# EAGLE design PGTNX01_teensy (EAGLE 8.5.2)
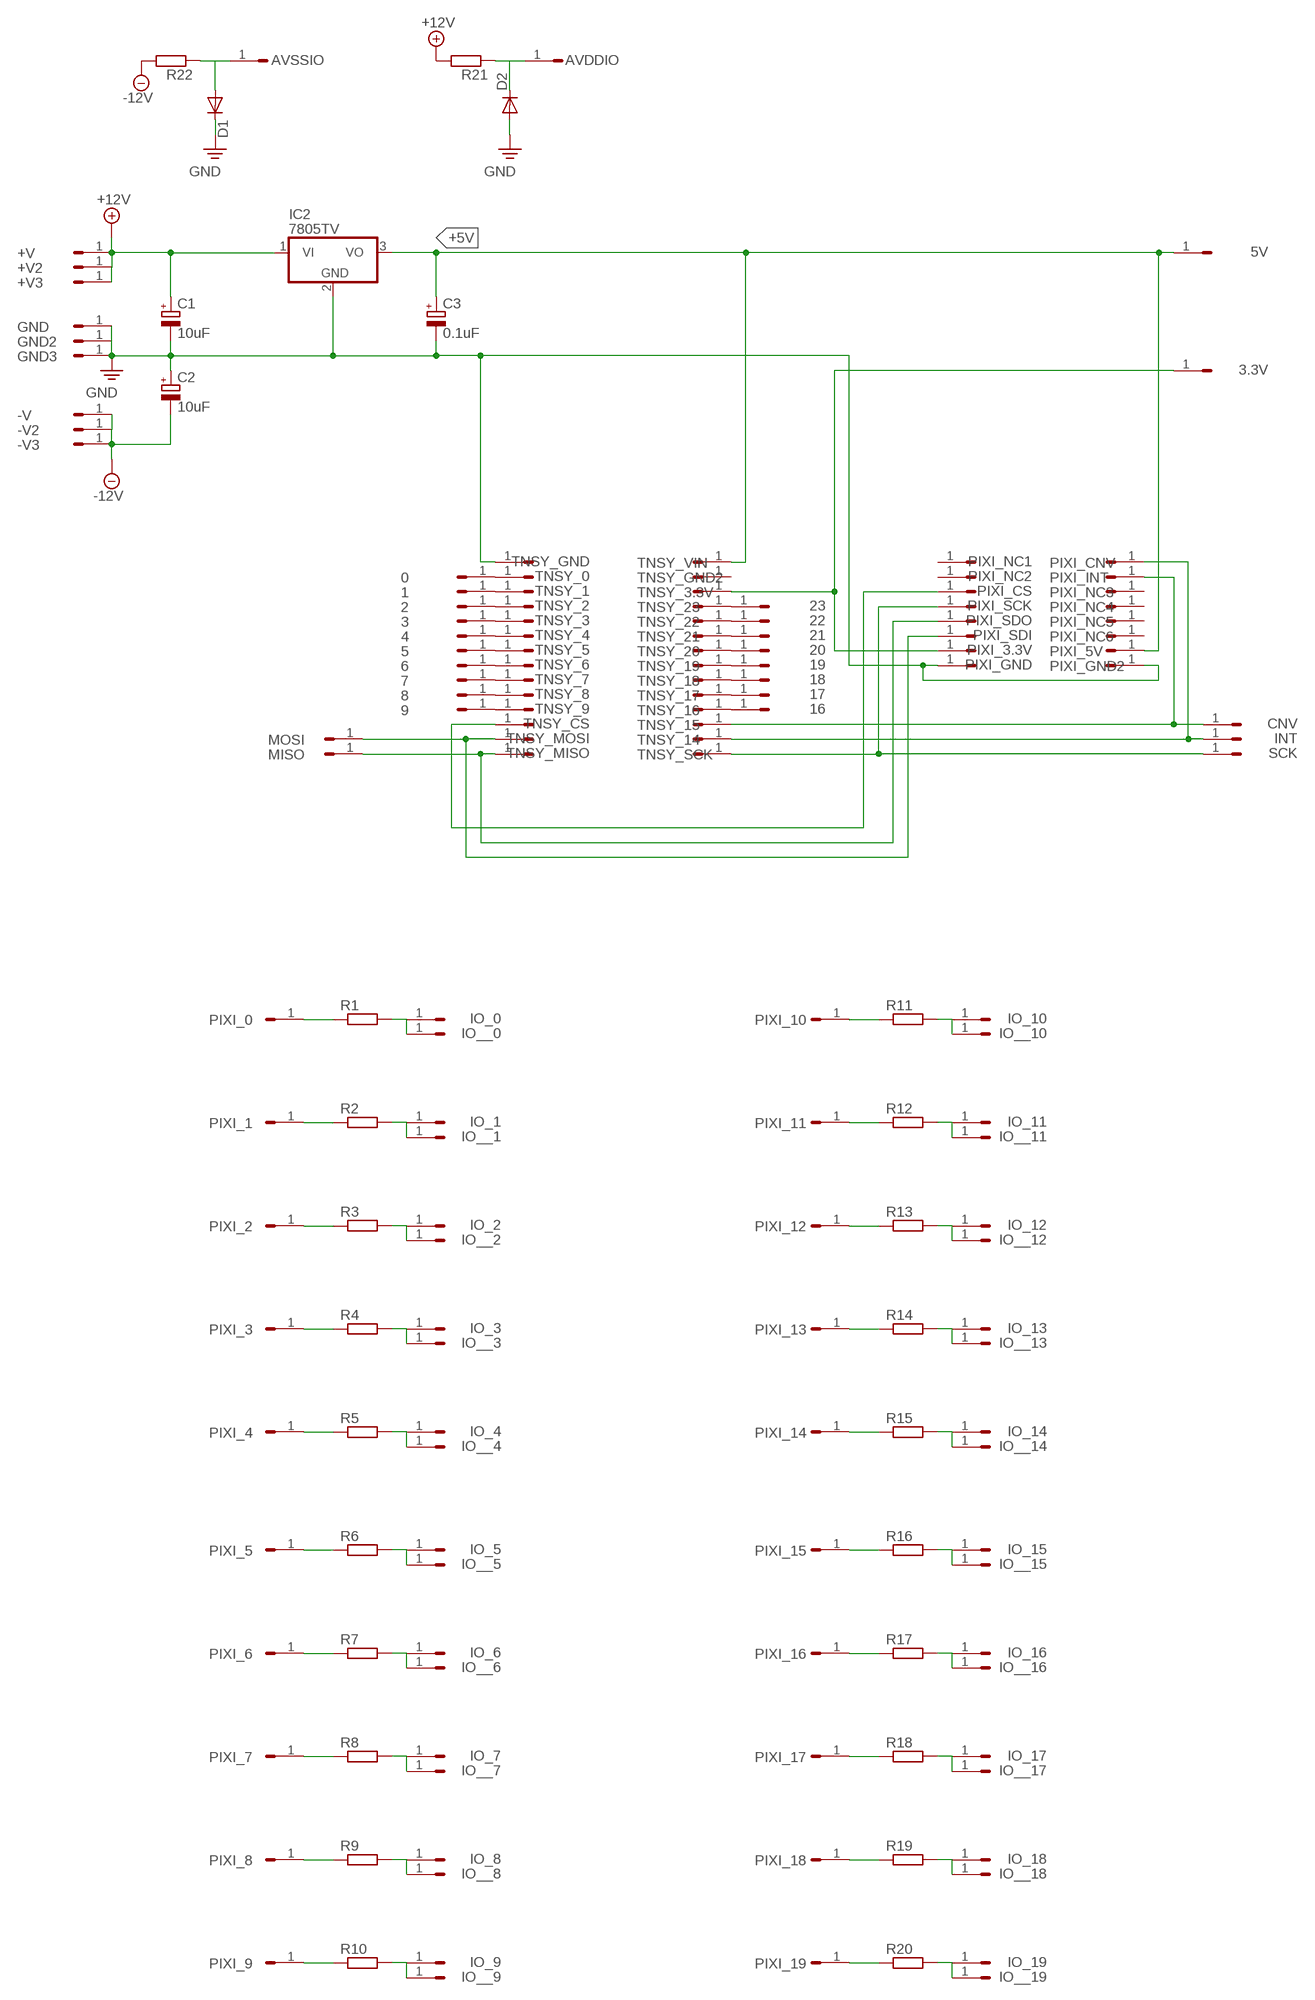
[diagram p0: schematic, sheet 1]

## Parts
0  HEADER/MALE/01  [HEADER/MALE/01]
1  HEADER/MALE/01  [HEADER/MALE/01]
2  HEADER/MALE/01  [HEADER/MALE/01]
3  HEADER/MALE/01  [HEADER/MALE/01]
3.3V  HEADER/MALE/01  [HEADER/MALE/01]
4  HEADER/MALE/01  [HEADER/MALE/01]
5  HEADER/MALE/01  [HEADER/MALE/01]
5V  HEADER/MALE/01  [HEADER/MALE/01]
6  HEADER/MALE/01  [HEADER/MALE/01]
7  HEADER/MALE/01  [HEADER/MALE/01]
8  HEADER/MALE/01  [HEADER/MALE/01]
9  HEADER/MALE/01  [HEADER/MALE/01]
16  HEADER/MALE/01  [HEADER/MALE/01]
17  HEADER/MALE/01  [HEADER/MALE/01]
18  HEADER/MALE/01  [HEADER/MALE/01]
19  HEADER/MALE/01  [HEADER/MALE/01]
20  HEADER/MALE/01  [HEADER/MALE/01]
21  HEADER/MALE/01  [HEADER/MALE/01]
22  HEADER/MALE/01  [HEADER/MALE/01]
23  HEADER/MALE/01  [HEADER/MALE/01]
+V  HEADER/MALE/01  [HEADER/MALE/01]
+V2  HEADER/MALE/01  [HEADER/MALE/01]
+V3  HEADER/MALE/01  [HEADER/MALE/01]
-V  HEADER/MALE/01  [HEADER/MALE/01]
-V2  HEADER/MALE/01  [HEADER/MALE/01]
-V3  HEADER/MALE/01  [HEADER/MALE/01]
AVDDIO  HEADER/MALE/01  [HEADER/MALE/01]
AVSSIO  HEADER/MALE/01  [HEADER/MALE/01]
C1  10uF  CAPACITOR/POLARIZEDE2.5-6  [E2,5-6]
C2  10uF  CAPACITOR/POLARIZEDE2.5-6  [E2,5-6]
C3  0.1uF  CAPACITOR/POLARIZEDE2.5-6  [E2,5-6]
CNV  HEADER/MALE/01  [HEADER/MALE/01]
D1  1N4148DO35-7  [DO35-7]
D2  1N4148DO35-7  [DO35-7]
GND  HEADER/MALE/01  [HEADER/MALE/01]
GND2  HEADER/MALE/01  [HEADER/MALE/01]
GND3  HEADER/MALE/01  [HEADER/MALE/01]
IC2  7805TV  [TO220V]
INT  HEADER/MALE/01  [HEADER/MALE/01]
IO_0  HEADER/MALE/01  [HEADER/MALE/01]
IO_1  HEADER/MALE/01  [HEADER/MALE/01]
IO_2  HEADER/MALE/01  [HEADER/MALE/01]
IO_3  HEADER/MALE/01  [HEADER/MALE/01]
IO_4  HEADER/MALE/01  [HEADER/MALE/01]
IO_5  HEADER/MALE/01  [HEADER/MALE/01]
IO_6  HEADER/MALE/01  [HEADER/MALE/01]
IO_7  HEADER/MALE/01  [HEADER/MALE/01]
IO_8  HEADER/MALE/01  [HEADER/MALE/01]
IO_9  HEADER/MALE/01  [HEADER/MALE/01]
IO_10  HEADER/MALE/01  [HEADER/MALE/01]
IO_11  HEADER/MALE/01  [HEADER/MALE/01]
IO_12  HEADER/MALE/01  [HEADER/MALE/01]
IO_13  HEADER/MALE/01  [HEADER/MALE/01]
IO_14  HEADER/MALE/01  [HEADER/MALE/01]
IO_15  HEADER/MALE/01  [HEADER/MALE/01]
IO_16  HEADER/MALE/01  [HEADER/MALE/01]
IO_17  HEADER/MALE/01  [HEADER/MALE/01]
IO_18  HEADER/MALE/01  [HEADER/MALE/01]
IO_19  HEADER/MALE/01  [HEADER/MALE/01]
IO__0  HEADER/MALE/01  [HEADER/MALE/01]
IO__1  HEADER/MALE/01  [HEADER/MALE/01]
IO__2  HEADER/MALE/01  [HEADER/MALE/01]
IO__3  HEADER/MALE/01  [HEADER/MALE/01]
IO__4  HEADER/MALE/01  [HEADER/MALE/01]
IO__5  HEADER/MALE/01  [HEADER/MALE/01]
IO__6  HEADER/MALE/01  [HEADER/MALE/01]
IO__7  HEADER/MALE/01  [HEADER/MALE/01]
IO__8  HEADER/MALE/01  [HEADER/MALE/01]
IO__9  HEADER/MALE/01  [HEADER/MALE/01]
IO__10  HEADER/MALE/01  [HEADER/MALE/01]
IO__11  HEADER/MALE/01  [HEADER/MALE/01]
IO__12  HEADER/MALE/01  [HEADER/MALE/01]
IO__13  HEADER/MALE/01  [HEADER/MALE/01]
IO__14  HEADER/MALE/01  [HEADER/MALE/01]
IO__15  HEADER/MALE/01  [HEADER/MALE/01]
IO__16  HEADER/MALE/01  [HEADER/MALE/01]
IO__17  HEADER/MALE/01  [HEADER/MALE/01]
IO__18  HEADER/MALE/01  [HEADER/MALE/01]
IO__19  HEADER/MALE/01  [HEADER/MALE/01]
MISO  HEADER/MALE/01  [HEADER/MALE/01]
MOSI  HEADER/MALE/01  [HEADER/MALE/01]
PIXI_0  HEADER/MALE/01  [HEADER/MALE/01]
PIXI_1  HEADER/MALE/01  [HEADER/MALE/01]
PIXI_2  HEADER/MALE/01  [HEADER/MALE/01]
PIXI_3  HEADER/MALE/01  [HEADER/MALE/01]
PIXI_3.3V  HEADER/MALE/01  [HEADER/MALE/01]
PIXI_4  HEADER/MALE/01  [HEADER/MALE/01]
PIXI_5  HEADER/MALE/01  [HEADER/MALE/01]
PIXI_5V  HEADER/MALE/01  [HEADER/MALE/01]
PIXI_6  HEADER/MALE/01  [HEADER/MALE/01]
PIXI_7  HEADER/MALE/01  [HEADER/MALE/01]
PIXI_8  HEADER/MALE/01  [HEADER/MALE/01]
PIXI_9  HEADER/MALE/01  [HEADER/MALE/01]
PIXI_10  HEADER/MALE/01  [HEADER/MALE/01]
PIXI_11  HEADER/MALE/01  [HEADER/MALE/01]
PIXI_12  HEADER/MALE/01  [HEADER/MALE/01]
PIXI_13  HEADER/MALE/01  [HEADER/MALE/01]
PIXI_14  HEADER/MALE/01  [HEADER/MALE/01]
PIXI_15  HEADER/MALE/01  [HEADER/MALE/01]
PIXI_16  HEADER/MALE/01  [HEADER/MALE/01]
PIXI_17  HEADER/MALE/01  [HEADER/MALE/01]
PIXI_18  HEADER/MALE/01  [HEADER/MALE/01]
PIXI_19  HEADER/MALE/01  [HEADER/MALE/01]
PIXI_CNV  HEADER/MALE/01  [HEADER/MALE/01]
PIXI_CS  HEADER/MALE/01  [HEADER/MALE/01]
PIXI_GND  HEADER/MALE/01  [HEADER/MALE/01]
PIXI_GND2  HEADER/MALE/01  [HEADER/MALE/01]
PIXI_INT  HEADER/MALE/01  [HEADER/MALE/01]
PIXI_NC1  HEADER/MALE/01  [HEADER/MALE/01]
PIXI_NC2  HEADER/MALE/01  [HEADER/MALE/01]
PIXI_NC3  HEADER/MALE/01  [HEADER/MALE/01]
PIXI_NC4  HEADER/MALE/01  [HEADER/MALE/01]
PIXI_NC5  HEADER/MALE/01  [HEADER/MALE/01]
PIXI_NC6  HEADER/MALE/01  [HEADER/MALE/01]
PIXI_SCK  HEADER/MALE/01  [HEADER/MALE/01]
PIXI_SDI  HEADER/MALE/01  [HEADER/MALE/01]
PIXI_SDO  HEADER/MALE/01  [HEADER/MALE/01]
R1  RESISTORRESISTOR/UPRIGHT/7.5  [RESISTOR/7.5]
R2  RESISTORRESISTOR/UPRIGHT/7.5  [RESISTOR/7.5]
R3  RESISTORRESISTOR/UPRIGHT/7.5  [RESISTOR/7.5]
R4  RESISTORRESISTOR/UPRIGHT/7.5  [RESISTOR/7.5]
R5  RESISTORRESISTOR/UPRIGHT/7.5  [RESISTOR/7.5]
R6  RESISTORRESISTOR/UPRIGHT/7.5  [RESISTOR/7.5]
R7  RESISTORRESISTOR/UPRIGHT/7.5  [RESISTOR/7.5]
R8  RESISTORRESISTOR/UPRIGHT/7.5  [RESISTOR/7.5]
R9  RESISTORRESISTOR/UPRIGHT/7.5  [RESISTOR/7.5]
R10  RESISTORRESISTOR/UPRIGHT/7.5  [RESISTOR/7.5]
R11  RESISTORRESISTOR/UPRIGHT/7.5  [RESISTOR/7.5]
R12  RESISTORRESISTOR/UPRIGHT/7.5  [RESISTOR/7.5]
R13  RESISTORRESISTOR/UPRIGHT/7.5  [RESISTOR/7.5]
R14  RESISTORRESISTOR/UPRIGHT/7.5  [RESISTOR/7.5]
R15  RESISTORRESISTOR/UPRIGHT/7.5  [RESISTOR/7.5]
R16  RESISTORRESISTOR/UPRIGHT/7.5  [RESISTOR/7.5]
R17  RESISTORRESISTOR/UPRIGHT/7.5  [RESISTOR/7.5]
R18  RESISTORRESISTOR/UPRIGHT/7.5  [RESISTOR/7.5]
R19  RESISTORRESISTOR/UPRIGHT/7.5  [RESISTOR/7.5]
R20  RESISTORRESISTOR/UPRIGHT/7.5  [RESISTOR/7.5]
R21  RESISTORRESISTOR/UPRIGHT/7.5  [RESISTOR/7.5]
R22  RESISTORRESISTOR/UPRIGHT/7.5  [RESISTOR/7.5]
SCK  HEADER/MALE/01  [HEADER/MALE/01]
TNSY_0  HEADER/MALE/01  [HEADER/MALE/01]
TNSY_1  HEADER/MALE/01  [HEADER/MALE/01]
TNSY_2  HEADER/MALE/01  [HEADER/MALE/01]
TNSY_3  HEADER/MALE/01  [HEADER/MALE/01]
TNSY_3.3V  HEADER/MALE/01  [HEADER/MALE/01]
TNSY_4  HEADER/MALE/01  [HEADER/MALE/01]
TNSY_5  HEADER/MALE/01  [HEADER/MALE/01]
TNSY_6  HEADER/MALE/01  [HEADER/MALE/01]
TNSY_7  HEADER/MALE/01  [HEADER/MALE/01]
TNSY_8  HEADER/MALE/01  [HEADER/MALE/01]
TNSY_9  HEADER/MALE/01  [HEADER/MALE/01]
TNSY_14  HEADER/MALE/01  [HEADER/MALE/01]
TNSY_15  HEADER/MALE/01  [HEADER/MALE/01]
TNSY_16  HEADER/MALE/01  [HEADER/MALE/01]
TNSY_17  HEADER/MALE/01  [HEADER/MALE/01]
TNSY_18  HEADER/MALE/01  [HEADER/MALE/01]
TNSY_19  HEADER/MALE/01  [HEADER/MALE/01]
TNSY_20  HEADER/MALE/01  [HEADER/MALE/01]
TNSY_21  HEADER/MALE/01  [HEADER/MALE/01]
TNSY_22  HEADER/MALE/01  [HEADER/MALE/01]
TNSY_23  HEADER/MALE/01  [HEADER/MALE/01]
TNSY_CS  HEADER/MALE/01  [HEADER/MALE/01]
TNSY_GND  HEADER/MALE/01  [HEADER/MALE/01]
TNSY_GND2  HEADER/MALE/01  [HEADER/MALE/01]
TNSY_MISO  HEADER/MALE/01  [HEADER/MALE/01]
TNSY_MOSI  HEADER/MALE/01  [HEADER/MALE/01]
TNSY_SCK  HEADER/MALE/01  [HEADER/MALE/01]
TNSY_VIN  HEADER/MALE/01  [HEADER/MALE/01]

## Nets
+5V: 5V.1 C3.+ IC2.3(VO) PIXI_5V.1 TNSY_VIN.1
+12V: +V2.1 +V3.1 +V.1 C1.+ IC2.1(VI) R21.2
-12V: -V2.1 -V3.1 -V.1 C2.- R22.2
GND: C1.- C2.+ C3.- D1.C D2.A GND2.1 GND3.1 GND.1 IC2.2(GND) PIXI_GND2.1 PIXI_GND.1 TNSY_GND.1
N$1: PIXI_0.1 R1.1
N$2: 17.1 TNSY_17.1
N$3: PIXI_1.1 R2.1
N$4: 16.1 TNSY_16.1
N$5: MOSI.1 PIXI_SDI.1 TNSY_MOSI.1
N$6: MISO.1 PIXI_SDO.1 TNSY_MISO.1
N$7: PIXI_SCK.1 SCK.1 TNSY_SCK.1
N$8: PIXI_CS.1 TNSY_CS.1
N$9: INT.1 PIXI_CNV.1 TNSY_14.1
N$10: CNV.1 PIXI_INT.1 TNSY_15.1
N$11: 18.1 TNSY_18.1
N$12: 19.1 TNSY_19.1
N$13: 20.1 TNSY_20.1
N$14: 21.1 TNSY_21.1
N$15: 22.1 TNSY_22.1
N$16: 23.1 TNSY_23.1
N$17: 0.1 TNSY_0.1
N$18: 1.1 TNSY_1.1
N$19: 2.1 TNSY_2.1
N$20: 3.1 TNSY_3.1
N$21: 4.1 TNSY_4.1
N$22: 5.1 TNSY_5.1
N$23: 6.1 TNSY_6.1
N$24: 7.1 TNSY_7.1
N$25: 8.1 TNSY_8.1
N$26: 9.1 TNSY_9.1
N$27: IO_1.1 IO__1.1 R2.2
N$28: 3.3V.1 PIXI_3.3V.1 TNSY_3.3V.1
N$29: IO_0.1 IO__0.1 R1.2
N$30: PIXI_2.1 R3.1
N$31: IO_2.1 IO__2.1 R3.2
N$32: PIXI_3.1 R4.1
N$33: IO_3.1 IO__3.1 R4.2
N$34: PIXI_4.1 R5.1
N$35: IO_4.1 IO__4.1 R5.2
N$36: PIXI_5.1 R6.1
N$37: IO_5.1 IO__5.1 R6.2
N$38: PIXI_6.1 R7.1
N$39: IO_6.1 IO__6.1 R7.2
N$40: PIXI_7.1 R8.1
N$41: IO_7.1 IO__7.1 R8.2
N$42: PIXI_8.1 R9.1
N$43: IO_8.1 IO__8.1 R9.2
N$44: PIXI_9.1 R10.1
N$45: IO_9.1 IO__9.1 R10.2
N$46: PIXI_10.1 R11.1
N$47: IO_10.1 IO__10.1 R11.2
N$48: PIXI_11.1 R12.1
N$49: IO_11.1 IO__11.1 R12.2
N$50: PIXI_12.1 R13.1
N$51: IO_12.1 IO__12.1 R13.2
N$52: PIXI_13.1 R14.1
N$53: IO_13.1 IO__13.1 R14.2
N$54: PIXI_14.1 R15.1
N$55: IO_14.1 IO__14.1 R15.2
N$56: PIXI_15.1 R16.1
N$57: IO_15.1 IO__15.1 R16.2
N$58: PIXI_16.1 R17.1
N$59: IO_16.1 IO__16.1 R17.2
N$60: PIXI_17.1 R18.1
N$61: IO_17.1 IO__17.1 R18.2
N$62: PIXI_18.1 R19.1
N$63: IO_18.1 IO__18.1 R19.2
N$64: PIXI_19.1 R20.1
N$65: IO_19.1 IO__19.1 R20.2
N$66: AVDDIO.1 D2.C R21.1
N$67: AVSSIO.1 D1.A R22.1
Unconnected: PIXI_NC1.1 PIXI_NC2.1 PIXI_NC3.1 PIXI_NC4.1 PIXI_NC5.1 PIXI_NC6.1 TNSY_GND2.1

## Library data of the parts
0 1-3 3.3V 4 5 5V 6-9 16-23 +V +V2 +V3 -V -V2 -V3 AVDDIO AVSSIO CNV GND GND2 GND3 INT IO_0 IO_1-IO_19 IO__0 IO__1-IO__19 MISO MOSI PIXI_0 PIXI_1-PIXI_3 PIXI_3.3V PIXI_4 PIXI_5 PIXI_5V PIXI_6-PIXI_19 PIXI_CNV PIXI_CS PIXI_GND PIXI_GND2 PIXI_INT PIXI_NC1-PIXI_NC6 PIXI_SCK PIXI_SDI PIXI_SDO SCK TNSY_0 TNSY_1-TNSY_3 TNSY_3.3V TNSY_4-TNSY_9 TNSY_14-TNSY_23 TNSY_CS TNSY_GND TNSY_GND2 TNSY_MISO TNSY_MOSI TNSY_SCK TNSY_VIN = connectors:HEADER/MALE/01; SPICEPREFIX: X
C1-C3 = capacitors:CAPACITOR/POLARIZED: POLARIZED CAPACITOR, European symbol; SPICEPREFIX: C
D1 D2 = transistors:1N4148: DIODE high speed (Philips)
IC2 = ic_voltage_reg:78*: Positive VOLTAGE REGULATOR Source: http://cache.national.com/ds/LM/LM78L05.pdf http://www.fairchildsemi.com/ds/LM/LM7805.pdf
R1-R22 = resistors:RESISTOR: RESISTOR, European symbol

## Board
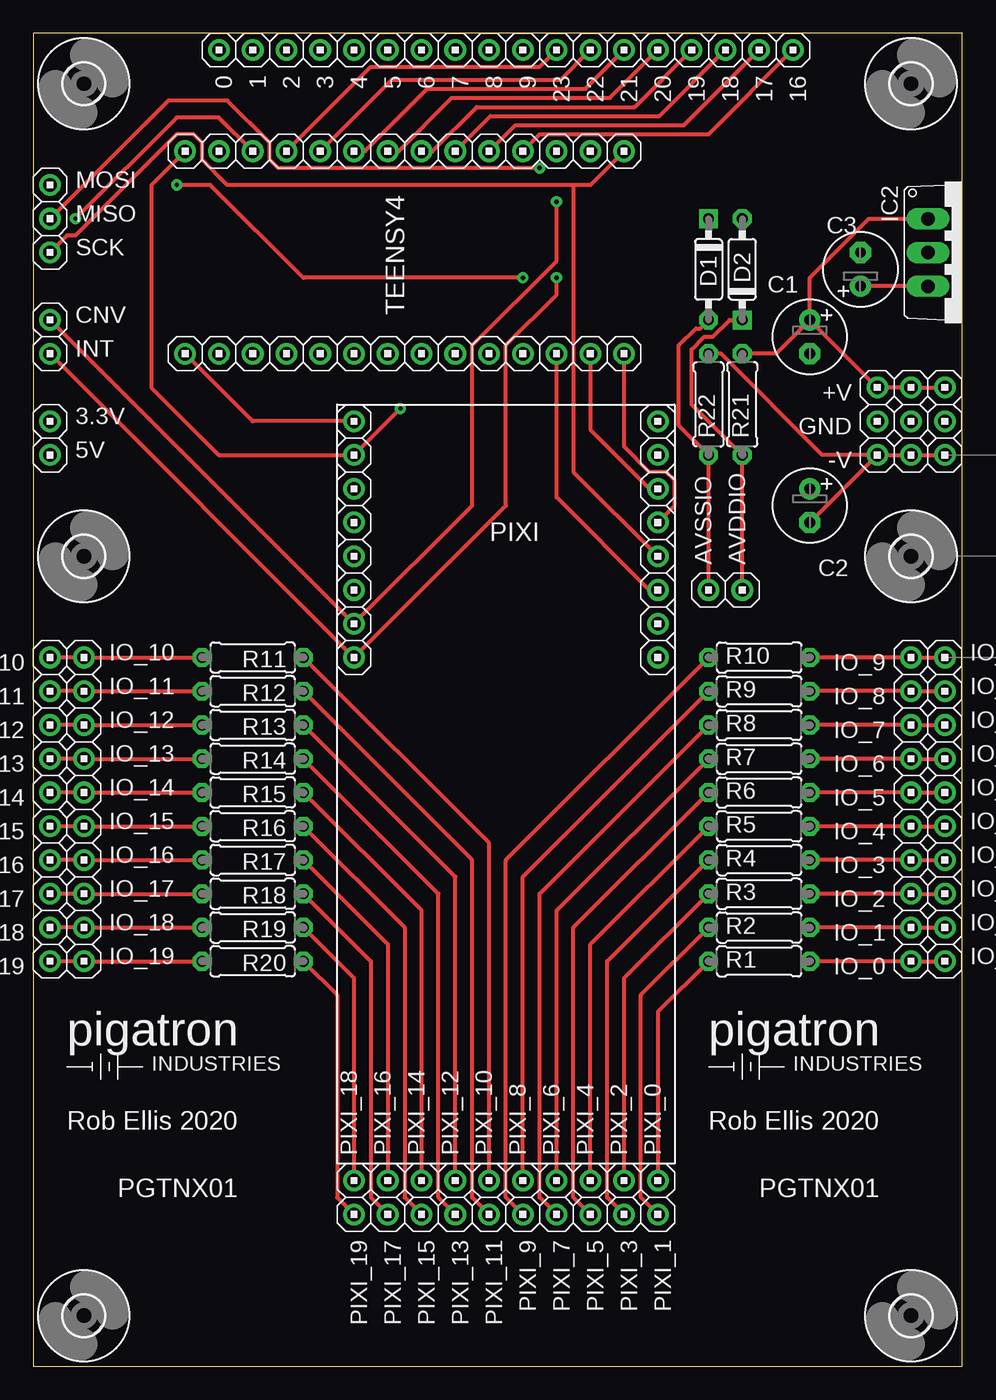
[diagram p1: board, top side]
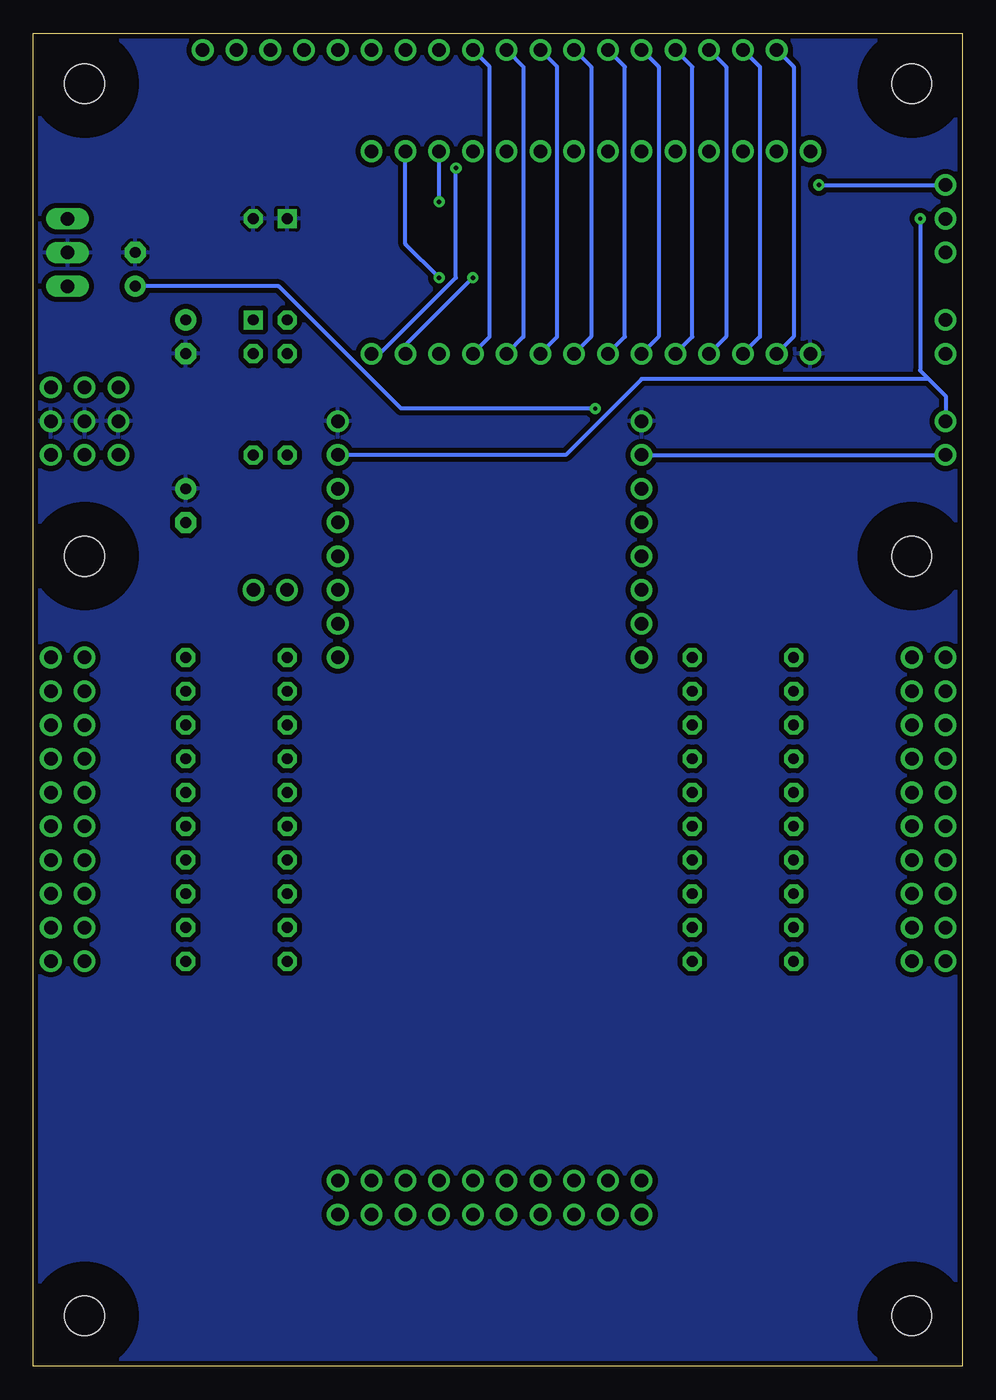
[diagram p2: board, bottom side, seen from below]

Size 69.9 x 100.32 mm. Coordinates in mm from the lower left corner, seen from the top.
Outline: 0,0 69.9,0 69.9,100.32 0,100.32 0,0
Copper layers (1*16): Top 0.0356mm / dielectric 1.5011mm / Bottom 0.0356mm
Design rules "pigatron": minimum track width 12mil, minimum drill 13mil, track to track 15mil, track to pad 10mil, pad to pad 10mil, via to via 10mil, smd to smd 6mil, copper to edge 15mil, drill to drill 10mil, minimum pad ring 12mil, minimum via ring 10mil, stop-mask expansion 4mil, vias tented up to drill 0mil, thermal gap 10mil

### Footprints (pad centres in the part's own frame; a part is rotated, then mirrored left to right if it is on the bottom)
HEADER/MALE/01 = drill 1.016: 1 0,0
E2,5-6 = drill 0.813 pad 1.6: + -1.27,0 | drill 0.813 pad 1.6 octagon: - 1.27,0
DO35-7 = drill 0.813 octagon: A 3.81,0 | drill 0.813 square: C -3.81,0
TO220V = drill 1.016 long: 1 -2.54,-2.54; 2 0,-2.54; 3 2.54,-2.54
RESISTOR/7.5 = drill 0.813 octagon: 1 -3.81,0; 2 3.81,0
STANDOFF/3.0 = hole 3: 0,0

### Placement (x,y rotation side)
0  13.97,99.06 270 top
1  16.51,99.06 270 top
2  19.05,99.06 270 top
3  21.59,99.06 270 top
3.3V  1.27,71.12 0 top
4  24.13,99.06 270 top
5  26.67,99.06 270 top
5V  1.27,68.58 0 top
6  29.21,99.06 270 top
7  31.75,99.06 270 top
8  34.29,99.06 270 top
9  36.83,99.06 270 top
16  57.15,99.06 270 top
17  54.61,99.06 270 top
18  52.07,99.06 270 top
19  49.53,99.06 270 top
20  46.99,99.06 270 top
21  44.45,99.06 270 top
22  41.91,99.06 270 top
23  39.37,99.06 270 top
+V  63.5,73.66 180 top
+V2  66.04,73.66 0 top
+V3  68.58,73.66 0 top
-V  63.5,68.58 180 top
-V2  66.04,68.58 0 top
-V3  68.58,68.58 0 top
AVDDIO  53.34,58.42 90 top
AVSSIO  50.8,58.42 90 top
C1  58.42,77.47 270 top
C2  58.42,64.77 270 top
C3  62.23,82.55 90 top
CNV  1.27,78.74 0 top
D1  BZX55C12  [DO35-7]  50.8,82.55 270 top
D2  BZX55C12  [DO35-7]  53.34,82.55 90 top
GND  63.5,71.12 180 top
GND2  68.58,71.12 0 top
GND3  66.04,71.12 0 top
IC2  69.85,83.82 270 top
INT  1.27,76.2 0 top
IO_0  66.04,30.48 180 top
IO_1  66.04,33.02 180 top
IO_2  66.04,35.56 180 top
IO_3  66.04,38.1 180 top
IO_4  66.04,40.64 180 top
IO_5  66.04,43.18 180 top
IO_6  66.04,45.72 180 top
IO_7  66.04,48.26 180 top
IO_8  66.04,50.8 180 top
IO_9  66.04,53.34 180 top
IO_10  3.81,53.34 0 top
IO_11  3.81,50.8 0 top
IO_12  3.81,48.26 0 top
IO_13  3.81,45.72 0 top
IO_14  3.81,43.18 0 top
IO_15  3.81,40.64 0 top
IO_16  3.81,38.1 0 top
IO_17  3.81,35.56 0 top
IO_18  3.81,33.02 0 top
IO_19  3.81,30.48 0 top
IO__0  68.58,30.48 0 top
IO__1  68.58,33.02 0 top
IO__2  68.58,35.56 0 top
IO__3  68.58,38.1 0 top
IO__4  68.58,40.64 0 top
IO__5  68.58,43.18 0 top
IO__6  68.58,45.72 0 top
IO__7  68.58,48.26 0 top
IO__8  68.58,50.8 0 top
IO__9  68.58,53.34 0 top
IO__10  1.27,53.34 180 top
IO__11  1.27,50.8 180 top
IO__12  1.27,48.26 180 top
IO__13  1.27,45.72 180 top
IO__14  1.27,43.18 180 top
IO__15  1.27,40.64 180 top
IO__16  1.27,38.1 180 top
IO__17  1.27,35.56 180 top
IO__18  1.27,33.02 180 top
IO__19  1.27,30.48 180 top
MISO  1.27,86.36 0 top
MOSI  1.27,88.9 0 top
PIXI_0  46.99,13.97 90 top
PIXI_1  46.99,11.43 270 top
PIXI_2  44.45,13.97 90 top
PIXI_3  44.45,11.43 270 top
PIXI_3.3V  46.99,68.58 180 top
PIXI_4  41.91,13.97 90 top
PIXI_5  41.91,11.43 270 top
PIXI_5V  24.13,68.58 0 top
PIXI_6  39.37,13.97 90 top
PIXI_7  39.37,11.43 270 top
PIXI_8  36.83,13.97 90 top
PIXI_9  36.83,11.43 270 top
PIXI_10  34.29,13.97 90 top
PIXI_11  34.29,11.43 270 top
PIXI_12  31.75,13.97 90 top
PIXI_13  31.75,11.43 270 top
PIXI_14  29.21,13.97 90 top
PIXI_15  29.21,11.43 270 top
PIXI_16  26.67,13.97 90 top
PIXI_17  26.67,11.43 270 top
PIXI_18  24.13,13.97 90 top
PIXI_19  24.13,11.43 270 top
PIXI_CNV  24.13,53.34 0 top
PIXI_CS  46.99,58.42 180 top
PIXI_GND  46.99,71.12 180 top
PIXI_GND2  24.13,71.12 0 top
PIXI_INT  24.13,55.88 0 top
PIXI_NC1  46.99,53.34 180 top
PIXI_NC2  46.99,55.88 180 top
PIXI_NC3  24.13,58.42 0 top
PIXI_NC4  24.13,60.96 0 top
PIXI_NC5  24.13,63.5 0 top
PIXI_NC6  24.13,66.04 0 top
PIXI_SCK  46.99,60.96 180 top
PIXI_SDI  46.99,66.04 180 top
PIXI_SDO  46.99,63.5 180 top
R1  54.61,30.48 0 top
R2  54.61,33.02 0 top
R3  54.61,35.56 0 top
R4  54.61,38.1 0 top
R5  54.61,40.64 0 top
R6  54.61,43.18 0 top
R7  54.61,45.72 0 top
R8  54.61,48.26 0 top
R9  54.61,50.8 0 top
R10  54.61,53.34 0 top
R11  16.51,53.34 180 top
R12  16.51,50.8 180 top
R13  16.51,48.26 180 top
R14  16.51,45.72 180 top
R15  16.51,43.18 180 top
R16  16.51,40.64 180 top
R17  16.51,38.1 180 top
R18  16.51,35.56 180 top
R19  16.51,33.02 180 top
R20  16.51,30.48 180 top
R21  53.34,72.39 90 top
R22  50.8,72.39 90 top
SCK  1.27,83.82 0 top
TNSY_0  13.97,76.2 90 top
TNSY_1  16.51,76.2 90 top
TNSY_2  19.05,76.2 90 top
TNSY_3  21.59,76.2 90 top
TNSY_3.3V  16.51,91.44 90 top
TNSY_4  24.13,76.2 90 top
TNSY_5  26.67,76.2 90 top
TNSY_6  29.21,76.2 90 top
TNSY_7  31.75,76.2 90 top
TNSY_8  34.29,76.2 90 top
TNSY_9  36.83,76.2 90 top
TNSY_14  41.91,91.44 90 top
TNSY_15  39.37,91.44 90 top
TNSY_16  36.83,91.44 90 top
TNSY_17  34.29,91.44 90 top
TNSY_18  31.75,91.44 90 top
TNSY_19  29.21,91.44 90 top
TNSY_20  26.67,91.44 90 top
TNSY_21  24.13,91.44 90 top
TNSY_22  21.59,91.44 90 top
TNSY_23  19.05,91.44 90 top
TNSY_CS  39.37,76.2 90 top
TNSY_GND  11.43,76.2 90 top
TNSY_GND2  13.97,91.44 90 top
TNSY_MISO  44.45,76.2 90 top
TNSY_MOSI  41.91,76.2 90 top
TNSY_SCK  44.45,91.44 90 top
TNSY_VIN  11.43,91.44 90 top
U$1  [STANDOFF/3.0]  3.81,60.96 0 top
U$2  [STANDOFF/3.0]  3.81,96.52 0 top
U$3  [STANDOFF/3.0]  66.04,96.52 0 top
U$4  [STANDOFF/3.0]  66.04,3.81 0 top
U$5  [PIGATRON-LOGO]  11.43,24.13 0 top
U$6  [STANDOFF/3.0]  66.04,60.96 0 top
U$7  [STANDOFF/3.0]  3.81,3.81 0 top
U$8  [PIGATRON-LOGO]  59.69,24.13 0 top

### Tracks (layer width: path | path; a pad name or v marks a point on that pad's centre or on a via)
+5V  (via drill 0.33)
  Top 0.305: TNSY_VIN.1 8.89,88.9 8.89,73.66 13.97,68.58 PIXI_5V.1 v27.62,72.07 | IC2.3 C3.+
  Bottom 0.305: PIXI_5V.1 5V.1 | C3.+ 51.44,81.28 42.23,72.07 v27.62,72.07
+12V
  Top 0.305: +V3.1 +V2.1 +V.1 C1.+ | R21.2 55.88,76.2 C1.+ | IC2.1 62.87,86.36 58.42,81.92 C1.+
-12V
  Top 0.305: -V.1 -V2.1 -V3.1 | R22.2 51.75,76.2 59.37,68.58 -V.1 | -V.1 C2.-
GND
  Top 0.305: PIXI_GND2.1 16.51,71.12 TNSY_GND.1
  pour Bottom: 0,100.33 69.85,100.33 69.85,0 0,0
N$1
  Top 0.305: R1.1 46.99,26.67 PIXI_0.1
N$2
  Top 0.305: TNSY_17.1 36.25,93.4 48.95,93.4 17.1
N$3
  Top 0.305: R2.1 45.72,27.94 45.72,12.7 PIXI_1.1
N$4
  Top 0.305: TNSY_16.1 38.1,92.71 50.8,92.71 16.1
N$5  (via drill 0.33)
  Top 0.305: PIXI_SDI.1 46.35,66.04 41.91,70.48 TNSY_MOSI.1 | v10.79,88.9 13.34,88.9 20.32,81.92 v36.83,81.92
  Bottom 0.305: v10.79,88.9 MOSI.1 | v36.83,81.92 41.91,76.83 TNSY_MOSI.1
N$6  (via drill 0.33)
  Top 0.305: TNSY_MISO.1 44.45,69.22 46.35,67.31 47.62,67.31 48.26,66.67 48.26,64.77 PIXI_SDO.1 | MISO.1 10.16,95.25 14.61,95.25 17.78,92.08 17.78,90.81 18.41,90.17 v38.1,90.17
  Bottom 0.305: v38.1,90.17 38.1,81.92 43.81,76.2 TNSY_MISO.1
N$7
  Top 0.305: SCK.1 2.54,85.09 3.17,85.09 10.79,92.71 12.06,92.71 12.7,92.08 12.7,90.81 14.61,88.9 40.64,88.9 | 40.64,88.9 41.91,88.9 TNSY_SCK.1 | PIXI_SCK.1 40.64,67.31 40.64,88.9
N$8
  Top 0.305: TNSY_CS.1 39.37,65.41 46.35,58.42 PIXI_CS.1
N$9  (via drill 0.33)
  Top 0.305: INT.1 PIXI_CNV.1 35.56,64.77 35.56,76.83 39.37,80.64 v39.37,81.92
  Bottom 0.305: TNSY_14.1 41.91,84.45 v39.37,81.92
N$10  (via drill 0.33)
  Top 0.305: CNV.1 PIXI_INT.1 33.02,64.77 33.02,76.83 39.37,83.19 v39.37,87.63
  Bottom 0.305: v39.37,87.63 TNSY_15.1
N$11
  Top 0.305: TNSY_18.1 34.39,94.08 47.09,94.08 18.1
N$12
  Top 0.305: 19.1 45.24,94.77 33.35,94.77 30.03,91.44 TNSY_19.1
N$13
  Top 0.305: 20.1 43.38,95.45 31.5,95.45 27.49,91.44 TNSY_20.1
N$14
  Top 0.305: 21.1 41.53,96.14 29.64,96.14 24.95,91.44 TNSY_21.1
N$15
  Top 0.305: TNSY_22.1 26.98,96.83 39.67,96.83 22.1
N$16
  Top 0.305: TNSY_23.1 25.4,97.79 38.1,97.79 23.1
N$17
  Bottom 0.305: 0.1 12.7,97.79 12.7,77.47 TNSY_0.1
N$18
  Bottom 0.305: 1.1 15.24,97.79 15.24,77.47 TNSY_1.1
N$19
  Bottom 0.305: 2.1 17.78,97.79 17.78,77.47 TNSY_2.1
N$20
  Bottom 0.305: TNSY_3.1 20.32,77.47 20.32,97.79 3.1
N$21
  Bottom 0.305: 4.1 22.86,97.79 22.86,77.47 TNSY_4.1
N$22
  Bottom 0.305: TNSY_5.1 25.4,77.47 25.4,97.79 5.1
N$23
  Bottom 0.305: 6.1 27.94,97.79 27.94,77.47 TNSY_6.1
N$24
  Bottom 0.305: TNSY_7.1 30.48,77.47 30.48,97.79 7.1
N$25
  Bottom 0.305: 8.1 33.02,97.79 33.02,77.47 TNSY_8.1
N$26
  Bottom 0.305: TNSY_9.1 35.56,77.47 35.56,97.79 9.1
N$27
  Top 0.305: R2.2 IO_1.1 IO__1.1
N$28  (via drill 0.33)
  Top 0.305: v3.17,86.36 10.79,93.98 13.97,93.98 TNSY_3.3V.1
  Bottom 0.305: 3.3V.1 1.27,73.03 2.54,74.3 | 2.54,74.3 3.17,74.93 v3.17,86.36 | PIXI_3.3V.1 29.84,68.58 24.13,74.3 2.54,74.3
N$29
  Top 0.305: R1.2 IO_0.1 IO__0.1
N$30
  Top 0.305: R3.1 44.45,29.21 PIXI_2.1
N$31
  Top 0.305: R3.2 IO_2.1 IO__2.1
N$32
  Top 0.305: R4.1 43.18,30.48 43.18,12.7 PIXI_3.1
N$33
  Top 0.305: R4.2 IO_3.1 IO__3.1
N$34
  Top 0.305: R5.1 41.91,31.75 PIXI_4.1
N$35
  Top 0.305: R5.2 IO_4.1 IO__4.1
N$36
  Top 0.305: R6.1 40.64,33.02 40.64,12.7 PIXI_5.1
N$37
  Top 0.305: R6.2 IO_5.1 IO__5.1
N$38
  Top 0.305: R7.1 39.37,34.29 PIXI_6.1
N$39
  Top 0.305: R7.2 IO_6.1 IO__6.1
N$40
  Top 0.305: R8.1 38.1,35.56 38.1,12.7 PIXI_7.1
N$41
  Top 0.305: R8.2 IO_7.1 IO__7.1
N$42
  Top 0.305: R9.1 36.83,36.83 PIXI_8.1
N$43
  Top 0.305: R9.2 IO_8.1 IO__8.1
N$44
  Top 0.305: R10.1 35.56,38.1 35.56,12.7 PIXI_9.1
N$45
  Top 0.305: R10.2 IO_9.1 IO__9.1
N$46
  Top 0.305: R11.1 34.29,39.37 PIXI_10.1
N$47
  Top 0.305: R11.2 IO_10.1 IO__10.1
N$48
  Top 0.305: R12.1 33.02,38.1 33.02,12.7 PIXI_11.1
N$49
  Top 0.305: R12.2 IO_11.1 IO__11.1
N$50
  Top 0.305: R13.1 31.75,36.83 PIXI_12.1
N$51
  Top 0.305: R13.2 IO_12.1 IO__12.1
N$52
  Top 0.305: R14.1 30.48,35.56 30.48,12.7 PIXI_13.1
N$53
  Top 0.305: R14.2 IO_13.1 IO__13.1
N$54
  Top 0.305: R15.1 29.21,34.29 PIXI_14.1
N$55
  Top 0.305: R15.2 IO_14.1 IO__14.1
N$56
  Top 0.305: R16.1 27.94,33.02 27.94,12.7 PIXI_15.1
N$57
  Top 0.305: R16.2 IO_15.1 IO__15.1
N$58
  Top 0.305: R17.1 26.67,31.75 PIXI_16.1
N$59
  Top 0.305: R17.2 IO_16.1 IO__16.1
N$60
  Top 0.305: R18.1 25.4,30.48 25.4,12.7 PIXI_17.1
N$61
  Top 0.305: R18.2 IO_17.1 IO__17.1
N$62
  Top 0.305: R19.1 24.13,29.21 PIXI_18.1
N$63
  Top 0.305: R19.2 IO_18.1 IO__18.1
N$64
  Top 0.305: R20.1 22.86,27.94 22.86,12.7 PIXI_19.1
N$65
  Top 0.305: R20.2 IO_19.1 IO__19.1
N$66
  Top 0.305: AVDDIO.1 R21.1 49.53,72.39 49.53,76.52 50.48,77.47 51.12,77.47 52.39,78.74 D2.C
N$67
  Top 0.305: AVSSIO.1 R22.1 48.58,70.8 48.58,76.83 49.85,78.11 50.16,78.11 D1.A

### Text on the board
tNames: TEENSY4 | PIXI | Rob Ellis 2020 | Rob Ellis 2020 | PGTNX01 | PGTNX01